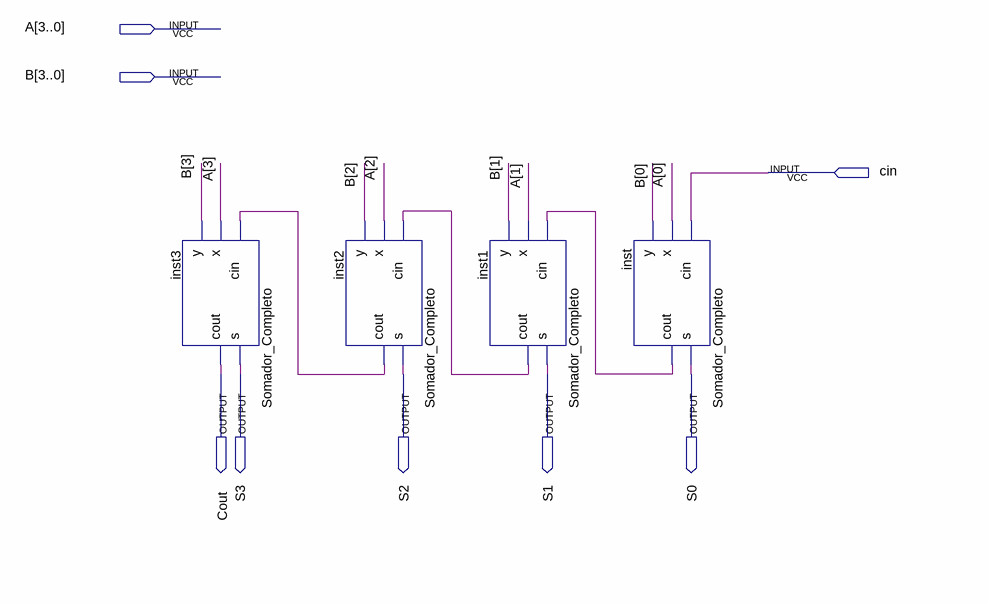
[diagram p0: schematic sheet]
// Quartus schematic Somador_4_Bits.bdf as structural Verilog: 4 symbols, 8 pins
module Somador_4_Bits (
  input  [3:0] A,
  input  [3:0] B,
  input  cin,
  output Cout,
  output S3,
  output S2,
  output S1,
  output S0
);

  wire inst1_cout, inst2_cout, inst_cout;

  Somador_Completo inst3 (.cin(inst2_cout), .x(A[3]), .y(B[3]), .s(S3), .cout(Cout));
  Somador_Completo inst2 (.cin(inst1_cout), .x(A[2]), .y(B[2]), .s(S2), .cout(inst2_cout));
  Somador_Completo inst1 (.cin(inst_cout), .x(A[1]), .y(B[1]), .s(S1), .cout(inst1_cout));
  Somador_Completo inst (.cin(cin), .x(A[0]), .y(B[0]), .s(S0), .cout(inst_cout));
endmodule
